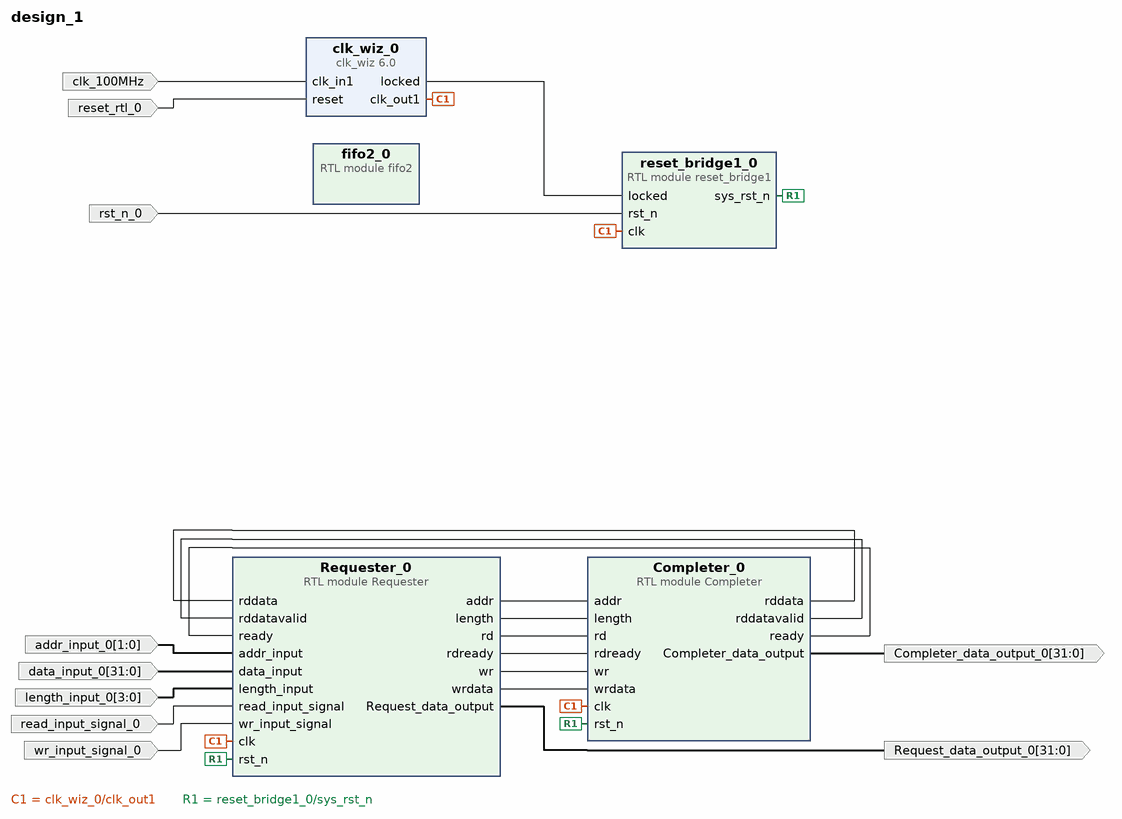
[diagram p0: block diagram of the top level]
# Vivado block design design_1, xc7a12ticsg325-1L, Vivado 2025.2
create_bd_design design_1

create_bd_port -dir I -type clk clk_100MHz
set_property -dict {CONFIG.FREQ_HZ 100000000} [get_bd_ports clk_100MHz]
create_bd_port -dir I -type rst reset_rtl_0
set_property -dict {CONFIG.POLARITY ACTIVE_HIGH} [get_bd_ports reset_rtl_0]
create_bd_port -dir I -from 31 -to 0 data_input_0
create_bd_port -dir I -from 3 -to 0 length_input_0
create_bd_port -dir I -from 1 -to 0 addr_input_0
create_bd_port -dir I read_input_signal_0
create_bd_port -dir I wr_input_signal_0
create_bd_port -dir O -from 31 -to 0 Request_data_output_0
create_bd_port -dir O -from 31 -to 0 Completer_data_output_0
create_bd_port -dir I -type rst rst_n_0

create_bd_cell -type ip -vlnv xilinx.com:ip:clk_wiz:6.0 clk_wiz_0
create_bd_cell -type module -reference Requester Requester_0
create_bd_cell -type module -reference Completer Completer_0
create_bd_cell -type module -reference fifo2 fifo2_0
create_bd_cell -type module -reference reset_bridge1 reset_bridge1_0

# ---- connections ----

connect_bd_net [get_bd_pins Completer_0/Completer_data_output] [get_bd_ports Completer_data_output_0]
connect_bd_net [get_bd_pins Completer_0/rddata] [get_bd_pins Requester_0/rddata]
connect_bd_net [get_bd_pins Completer_0/rddatavalid] [get_bd_pins Requester_0/rddatavalid]
connect_bd_net [get_bd_pins Completer_0/ready] [get_bd_pins Requester_0/ready]
connect_bd_net [get_bd_pins Requester_0/Request_data_output] [get_bd_ports Request_data_output_0]
connect_bd_net [get_bd_pins Requester_0/addr] [get_bd_pins Completer_0/addr]
connect_bd_net [get_bd_pins Requester_0/length] [get_bd_pins Completer_0/length]
connect_bd_net [get_bd_pins Requester_0/rd] [get_bd_pins Completer_0/rd]
connect_bd_net [get_bd_pins Requester_0/rdready] [get_bd_pins Completer_0/rdready]
connect_bd_net [get_bd_pins Requester_0/wr] [get_bd_pins Completer_0/wr]
connect_bd_net [get_bd_pins Requester_0/wrdata] [get_bd_pins Completer_0/wrdata]
connect_bd_net -net addr_input_0_1 [get_bd_ports addr_input_0] [get_bd_pins Requester_0/addr_input]
connect_bd_net [get_bd_ports clk_100MHz] [get_bd_pins clk_wiz_0/clk_in1]
connect_bd_net [get_bd_pins clk_wiz_0/clk_out1] [get_bd_pins Completer_0/clk] [get_bd_pins Requester_0/clk] [get_bd_pins reset_bridge1_0/clk]
connect_bd_net [get_bd_pins clk_wiz_0/locked] [get_bd_pins reset_bridge1_0/locked]
connect_bd_net -net data_input_0_1 [get_bd_ports data_input_0] [get_bd_pins Requester_0/data_input]
connect_bd_net -net length_input_0_1 [get_bd_ports length_input_0] [get_bd_pins Requester_0/length_input]
connect_bd_net -net read_input_signal_0_1 [get_bd_ports read_input_signal_0] [get_bd_pins Requester_0/read_input_signal]
connect_bd_net -net reset_bridge_0_sys_rst_n [get_bd_pins reset_bridge1_0/sys_rst_n] [get_bd_pins Completer_0/rst_n] [get_bd_pins Requester_0/rst_n]
connect_bd_net -net reset_rtl_0_1 [get_bd_ports reset_rtl_0] [get_bd_pins clk_wiz_0/reset]
connect_bd_net -net rst_n_0_1 [get_bd_ports rst_n_0] [get_bd_pins reset_bridge1_0/rst_n]
connect_bd_net -net wr_input_signal_0_1 [get_bd_ports wr_input_signal_0] [get_bd_pins Requester_0/wr_input_signal]

validate_bd_design
save_bd_design
